# Altium schematic sheet RPI 3.SchDoc
size A4; SheetNumber: 1; SheetTotal: 1
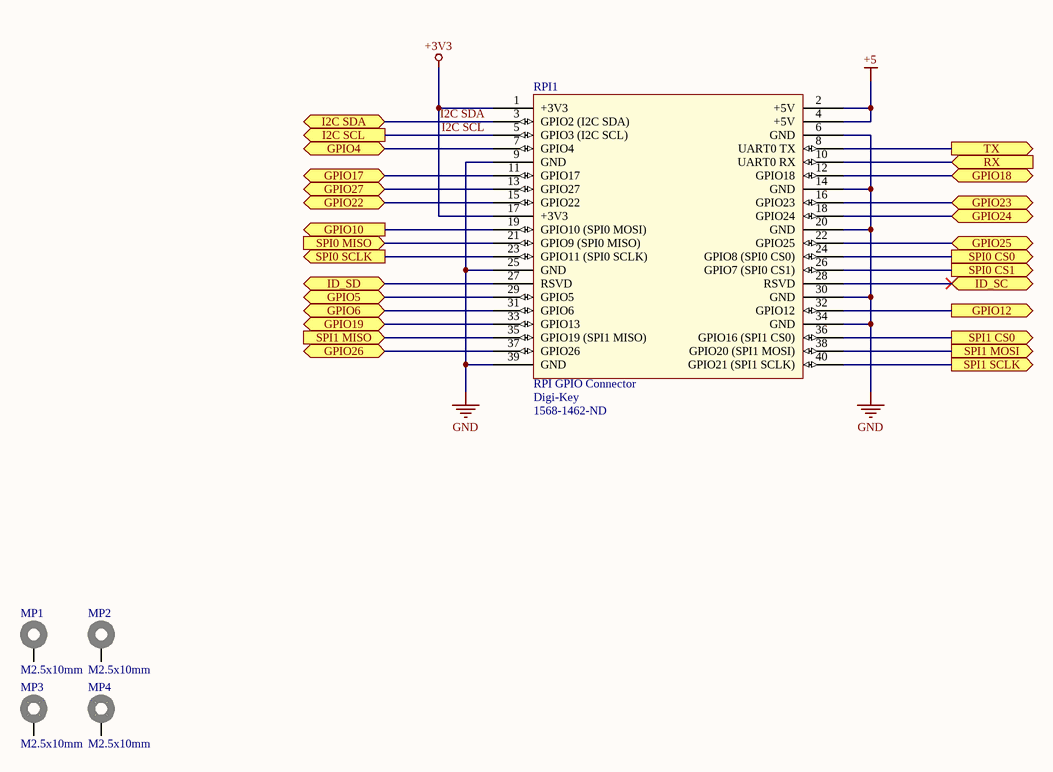
[diagram p0: RPI 3.SchDoc]

## Parts
MP1  M2.5x10mm  [9774100151]
MP2  M2.5x10mm  [9774100151]
MP3  M2.5x10mm  [9774100151]
MP4  M2.5x10mm  [9774100151]
RPI1  RPI GPIO Connector  Supplier 1: Digi-Key  Supplier Part Number 1: 1568-1462-ND  [rpi]

## Ports
GPIO4 (bidir), GPIO5 (bidir), GPIO6 (bidir), GPIO10 (out), GPIO12 (out), GPIO17 (bidir), GPIO18 (bidir), GPIO19 (bidir), GPIO22 (bidir), GPIO23 (bidir), GPIO24 (bidir), GPIO25 (bidir), GPIO26 (bidir), GPIO27 (bidir), I2C SCL (out), I2C SDA (bidir), ID_SC (bidir), ID_SD (bidir), RX (in), SPI0 CS0 (out), SPI0 CS1 (out), SPI0 MISO (in), SPI0 SCLK (out), SPI1 CS0 (out), SPI1 MISO (in), SPI1 MOSI (out), SPI1 SCLK (out), TX (out)

## Nets
+3V3: RPI1.1(+3V3) RPI1.17(+3V3)
+5: RPI1.2(+5V) RPI1.4(+5V)
GND: RPI1.6(GND) RPI1.9(GND) RPI1.14(GND) RPI1.20(GND) RPI1.25(GND) RPI1.30(GND) RPI1.34(GND) RPI1.39(GND)
GPIO4: RPI1.7(GPIO4) ; port GPIO4
GPIO5: RPI1.29(GPIO5) ; port GPIO5
GPIO6: RPI1.31(GPIO6) ; port GPIO6
GPIO10: RPI1.19(GPIO10_(SPI0_MOSI)) ; port GPIO10
GPIO12: RPI1.32(GPIO12) ; port GPIO12
GPIO17: RPI1.11(GPIO17) ; port GPIO17
GPIO18: RPI1.12(GPIO18) ; port GPIO18
GPIO19: RPI1.33(GPIO13) ; port GPIO19
GPIO22: RPI1.15(GPIO22) ; port GPIO22
GPIO23: RPI1.16(GPIO23) ; port GPIO23
GPIO24: RPI1.18(GPIO24) ; port GPIO24
GPIO25: RPI1.22(GPIO25) ; port GPIO25
GPIO26: RPI1.37(GPIO26) ; port GPIO26
GPIO27: RPI1.13(GPIO27) ; port GPIO27
I2C SCL: RPI1.5(GPIO3_(I2C_SCL)) ; port I2C SCL
I2C SDA: RPI1.3(GPIO2_(I2C_SDA)) ; port I2C SDA
ID_SC: RPI1.28(RSVD) ; port ID_SC
ID_SD: RPI1.27(RSVD) ; port ID_SD
RX: RPI1.10(UART0_RX) ; port RX
SPI0 CS0: RPI1.24(GPIO8_(SPI0_CS0)) ; port SPI0 CS0
SPI0 CS1: RPI1.26(GPIO7_(SPI0_CS1)) ; port SPI0 CS1
SPI0 MISO: RPI1.21(GPIO9_(SPI0_MISO)) ; port SPI0 MISO
SPI0 SCLK: RPI1.23(GPIO11_(SPI0_SCLK)) ; port SPI0 SCLK
SPI1 CS0: RPI1.36(GPIO16_(SPI1_CS0)) ; port SPI1 CS0
SPI1 MISO: RPI1.35(GPIO19_(SPI1_MISO)) ; port SPI1 MISO
SPI1 MOSI: RPI1.38(GPIO20_(SPI1_MOSI)) ; port SPI1 MOSI
SPI1 SCLK: RPI1.40(GPIO21_(SPI1_SCLK)) ; port SPI1 SCLK
TX: RPI1.8(UART0_TX) ; port TX

Not connected (* = marked no-connect by the designer): MP1 1; MP2 1; MP3 1; MP4 1

## Library data of the parts
MP1-MP4 = 9774100151: WA-SMSI SMT Steel Spacer, OD5.1mm, M2.5x10mm; Inner Diameter: 3.5mm; Outer Diameter: 5.1mm; Surface: Tin; Thread: M2.5; ComponentLink1Description: Manufacturer; ComponentLink1URL: http://www.we-online.de; ComponentLink2Description: Datasheet; ComponentLink2URL: https://katalog.we-online.com/em/datasheet/9774100151.pdf; Mounting Technology: SMT; Packaging: Bulk; Part Number: 9774100151; Length: 10mm; Inner Thread Length: -; Operating Temperature: -55 to +150degC; Publisher: Wurth Elektronik; Published Date: September 2019; Material: Steel
RPI1 = rpi connector: GPIO Header for Raspberry Pi A+/B+/Pi 2/Pi 3 - 2x20; Manufacturer: SparkFun Electronics; Manufacturer Part Number: PRT-14017; Nils Minor: author; nilsminor@web.de: mail; RoHS: RoHS Compliant; Category: Development Boards, Kits, Programmers; Stock 1: 150; Pricing 1: 1=1.84 (EUR); Part Status: Active; Accessory Type: Connector; For Use With/Related Products: Raspberry Pi; ComponentLink1URL: https://cdn.sparkfun.com/datasheets/Dev/RaspberryPi/12313.pdf; ComponentLink1Description: https://cdn.sparkfun.com/datasheets/Dev/RaspberryPi/12313.pdf